# Altium schematic sheet PERIPHERALS.SchDoc
size A4
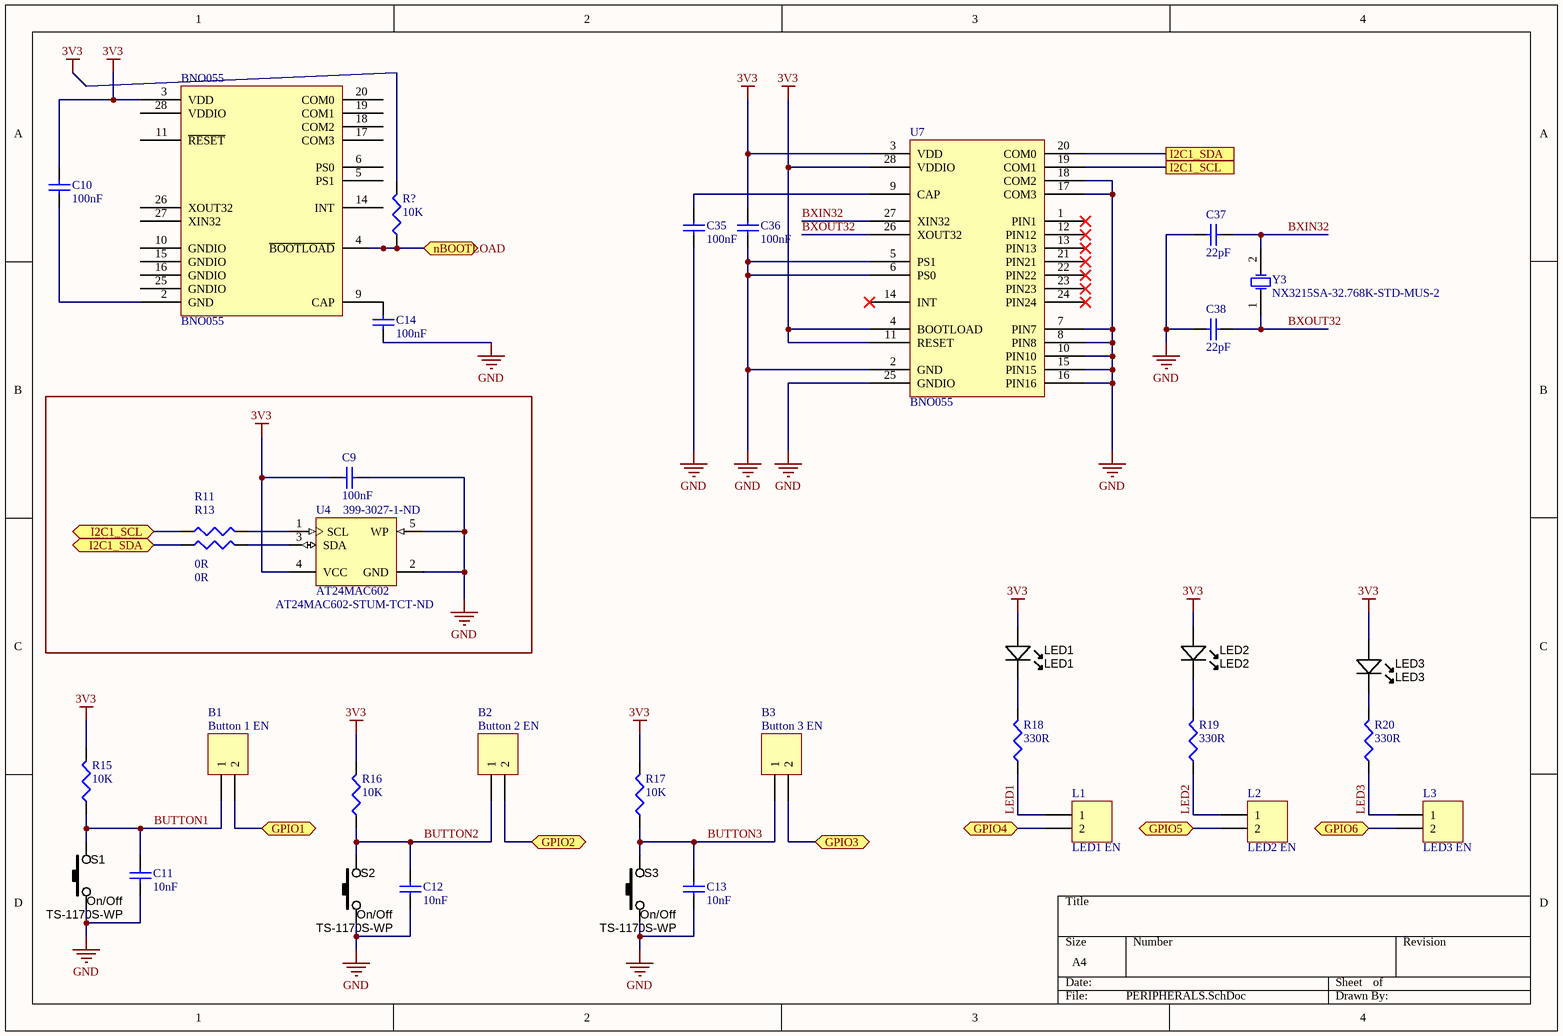
[diagram p0: PERIPHERALS.SchDoc]

## Parts
B1  Button 1 EN  [HDR1X2]
B2  Button 2 EN  [HDR1X2]
B3  Button 3 EN  [HDR1X2]
BNO055  BNO055  [BOSCH LGA-28 5.2x3.8MM]
C9  value 100nF  Supplier Part Number 1: 399-3027-1-ND  [0402C-TBD]  (hidden comment: Cap Semi)
C10  value 100nF  [0402C-TBD]  (hidden comment: Cap Semi)
C11  value 10nF  [0402C-TBD]  (hidden comment: Cap Semi)
C12  value 10nF  [0402C-TBD]  (hidden comment: Cap Semi)
C13  value 10nF  [0402C-TBD]  (hidden comment: Cap Semi)
C14  value 100nF  [0402C-TBD]  (hidden comment: Cap Semi)
C35  value 100nF  [0402C-TBD]  (hidden comment: Cap Semi)
C36  value 100nF  [0402C-TBD]  (hidden comment: Cap Semi)
C37  value 22pF  [0402C-TBD]  (hidden comment: Cap Semi)
C38  value 22pF  [0402C-TBD]  (hidden comment: Cap Semi)
L1  LED1 EN  [HDR1X2]
L2  LED2 EN  [HDR1X2]
L3  LED3 EN  [HDR1X2]
LED1  LED1  [LED-0603-GREEN]
LED2  LED2  [LED-0603-GREEN]
LED3  LED3  [LED-0603-GREEN]
R11  value 0R  [0402R-TBD]  (hidden comment: Res3)
R13  value 0R  [0402R-TBD]  (hidden comment: Res3)
R15  value 10K  [0402R-TBD]  (hidden comment: Res3)
R16  value 10K  [0402R-TBD]  (hidden comment: Res3)
R17  value 10K  [0402R-TBD]  (hidden comment: Res3)
R18  value 330R  [0402R-TBD]  (hidden comment: Res3)
R19  value 330R  [0402R-TBD]  (hidden comment: Res3)
R20  value 330R  [0402R-TBD]  (hidden comment: Res3)
R?  value 10K  [0402R-TBD]  (hidden comment: Res3)
S1  TS-1170S-WP  Function: On/Off  [TS-1170S]
S2  TS-1170S-WP  Function: On/Off  [TS-1170S]
S3  TS-1170S-WP  Function: On/Off  [TS-1170S]
U4  AT24MAC602  Supplier Part Number 1: AT24MAC602-STUM-TCT-ND  [ATML-5TS1-5_N]
U7  BNO055  [BNO055]
Y3  NX3215SA-32.768K-STD-MUS-2  [ABRA-ABS07-2_V]

## Ports
GPIO1 (bidir), GPIO2 (bidir), GPIO3 (bidir), GPIO4 (bidir), GPIO5 (bidir), GPIO6 (bidir), I2C1_SCL, I2C1_SCL (bidir), I2C1_SDA, I2C1_SDA (bidir), nBOOTLOAD (bidir)

## Nets
3V3: BNO055.3(VDD) C9.2 C10.2 C36.2 LED1.A LED2.A LED3.A R15.2 R16.2 R17.2 R?.2 U4.4(VCC) U7.3(VDD) U7.4(BOOTLOAD) U7.11(RESET) U7.28(VDDIO)
GND: C9.1 C11.1 C12.1 C13.1 C14.1 C35.1 C36.1 C37.2 C38.2 S1.1 S2.1 S3.1 U4.2(GND) U4.5(WP) U7.2(GND) U7.5(PS1) U7.6(PS0) U7.7(PIN7) U7.8(PIN8) U7.10(PIN10) U7.15(PIN15) U7.16(PIN16) U7.17(COM3) U7.18(COM2) U7.25(GNDIO)
BUTTON1: B1.1 C11.2 R15.1 S1.2
BUTTON2: B2.1 C12.2 R16.1 S2.2
BUTTON3: B3.1 C13.2 R17.1 S3.2
BXIN32: C37.1 U7.27(XIN32) Y3.2(X2)
BXOUT32: C38.1 U7.26(XOUT32) Y3.1(X1)
GPIO1: B1.2 ; port GPIO1
GPIO2: B2.2 ; port GPIO2
GPIO3: B3.2 ; port GPIO3
GPIO4: L1.2 ; port GPIO4
GPIO5: L2.2 ; port GPIO5
GPIO6: L3.2 ; port GPIO6
I2C1_SCL: R11.1 U7.19(COM1) ; port I2C1_SCL
I2C1_SDA: R13.1 U7.20(COM0) ; port I2C1_SDA
LED1: L1.1 R18.1
LED2: L2.1 R19.1
LED3: L3.1 R20.1
nBOOTLOAD: BNO055.4(~{BOOTL}~{OAD}) R?.1 ; port nBOOTLOAD
NetBNO055_2: BNO055.2(GND) C10.1
NetBNO055_9: BNO055.9(CAP) C14.2
NetC35_2: C35.2 U7.9(CAP)
NetLED1_K: LED1.K R18.2
NetLED2_K: LED2.K R19.2
NetLED3_K: LED3.K R20.2
NetR11_2: R11.2 U4.1(SCL)
NetR13_2: R13.2 U4.3(SDA)

Not connected (* = marked no-connect by the designer): BNO055 5(PS1) 6(PS0) 10(GNDIO) 11(~{RESET}) 14(INT) 15(GNDIO) 16(GNDIO) 17(COM3) 18(COM2) 19(COM1) 20(COM0) 25(GNDIO) 26(XOUT32) 27(XIN32) 28(VDDIO); U7 1(PIN1)* 12(PIN12)* 13(PIN13)* 14(INT)* 21(PIN21)* 22(PIN22)* 23(PIN23)* 24(PIN24)*

## Library data of the parts
B1-B3 L1-L3 = Header 2: Header, 2-Pin; LatestRevisionDate: 17-Jul-2002; LatestRevisionNote: Re-released for DXP Platform.; Publisher: Altium Limited
BNO055 = BNO055: 9 AXIS ORIENTATION SENSOR; Manufacturer: Bosch Sensortec; Sensor Type: Accelerometer, Gyroscope, Magnetometer, 3 Axis; Output Type: IC; Part Number: BNO055; PartId: 16469; Supplier 1: Digi-Key; Supplier Part Number 1: 828-1058-2-ND; ComponentLink1Description: Datasheet; ComponentLink1URL: https://ae-bst.resource.bosch.com/media/_tech/media/others/BST_Produktuebersicht_SCREEN_Final.pdf; ComponentLink2Description: Digi-Key Listing; ComponentLink2URL: http://www.digikey.com/product-detail/en/bosch-sensortec/BNO055/828-1058-2-ND/6136301; Price: 6.325; Type: Multifunction; Series: -; Operating Temperature: -40C ~ 85C (TA)
C9 C10 C14 C35 C36 = Cap Semi: Capacitor (Semiconductor SIM Model); Manufacturer: Kemet; Manufacturer Part Number: C0402C104K8PACTU; Capacitance: 0.1µF; Voltage - Rated: 10V; Tolerance: ±10%; Temperature Coefficient: X5R; Published: 8-Jun-2000; LatestRevisionDate: 29-May-2009; LatestRevisionNote: IPC-7351 Footprint Added.; PackageReference: C1206; Publisher: Altium Limited; PackageDescription: Chip Capacitor; Supplier 1: Digi-Key; RoHS: RoHS Compliant; Category: Capacitors; Stock 1: 563500; Pricing 1: 1=0.12, 10=0.03, 50=0.0166, 100=0.014, 250=0.01148, 500=0.0098, 1000=0.00763, 2500=0.00686, 5000=0.00636 (CAD); Packaging: Cut Tape (CT); Mounting Type: Surface Mount, MLCC; Operating Temperature: -55°C ~ 85°C; Applications: General Purpose; Ratings: -; Package / Case: 0402 (1005 Metric); Size / Dimension: 0.039" L x 0.020" W (1.00mm x 0.50mm); Height - Seated (Max): -; Thickness (Max): 0.022" (0.55mm); Lead Spacing: -; Features: -; Lead Style: -; ComponentLink1URL: http://www.kemet.com/docfinder?Partnumber=C0402C104K8PACTU; ComponentLink1Description: http://www.kemet.com/docfinder?Partnumber=C0402C104K8PACTU
  C10 C14 C35 C36: Supplier Part Number 1: 399-3027-1-ND
C11-C13 C37 C38 = Cap Semi: Capacitor (Semiconductor SIM Model); Published: 8-Jun-2000; LatestRevisionDate: 29-May-2009; LatestRevisionNote: IPC-7351 Footprint Added.; PackageReference: C1206; Publisher: Altium Limited; PackageDescription: Chip Capacitor
LED1-LED3 = LED_SMD_Green_0603_570nm: LED 0603 SMD Green 570nm 50mcd 20mA; Manufacturer 1: Kingbright Company LLC; Manufacturer Part Number 1: APT1608CGCK; Material: AlGaInP; Ratings: 20mcd min; 50 mcd typ; 570 nm; Voltage - Forward (Vf) Typ: 2.1V; Viewing Angle: 120°; Lens Style/Size: Rectangle with Flat Top, 1.1mm x 0.8mm; Voltage - Forward (Vf) @ 10mA: 2.0V; SCDType: source; Wavelength - Peak: 574nm; Lens Type: Clear; Package / Case: 0603 (1608 metric); Color: Green; Current - Test: 20mA; Supplier 1: Digi-Key; Supplier Part Number 1: 754-1116-1-ND; RoHS 1: RoHS Compliant; Wavelength - Dominant: 570nm; ComponentLink1URL: http://www.us.kingbright.com/images/catalog/SPEC/APT1608CGCK.pdf; ComponentLink1Description: http://www.us.kingbright.com/images/catalog/SPEC/APT1608CGCK.pdf
R11 R13 R15-R20 R? = Res3: Resistor; Published: 8-Jun-2000; LatestRevisionDate: 29-May-2009; LatestRevisionNote: IPC-7351 Footprint Added.; PackageReference: J1-0603; Publisher: Altium Limited; PackageDescription: Chip Resistor; Digi-Key Part Number: 541-120GCT-ND
S1-S3 = SW_SMD_PB_7.0mm: Switch SMD Tact 7.0mm Stem; Manufacturer 1: Bond-Tact; Manufacturer Part Number 1: TS-1170S-WP-200; SCDType: source; Package / Case: 6.5x6.5mm; 7.0mm stem; ComponentLink1URL: http://www.bondtact.com.hk/zaspx/productd.aspx?catno=3&subcatid=3&PageNo=2&productno=40; ComponentLink1Description: http://www.bondtact.com.hk/zaspx/productd.aspx?catno=3&subcatid=3&PageNo=2&productno=40
U4 = CMP-0152-00057-1: 1Kbit (128 x 8), 2-wire Bus Serial EEPROM with Write Protect, 1.7 to 5.5 V, -40 to 85 degC, SOT23-5, RoHS, Tape and Reel; Manufacturer: Atmel; PartNumber: AT24C01C-STUM-T; Manufacturer Part Number: AT24MAC602-STUM-T; Access Time (Max): 550 ns; DC Output Current: 5 mA; Frequency: 1 MHz; Format - Memory: EEPROMs - Serial (with MAC Address); Memory Size: 2K (256 x 8); Speed: 400kHz, 1MHz; Interface: I²C, 2-Wire Serial; Voltage - Supply: 1.7 V ~ 5.5 V; ComponentLink3Description: Package Specification; PackageVersion: 8700F; Mounting Technology: Surface Mount; Packing: Tape and Reel; ComponentLink1Description: Manufacturer URL; RoHS: TRUE; Operating Temperature: -40 to 85 degC; Operating Voltage: 1.7 to 5.5 V; PackageDescription: 5-Pin SOT23, Body 2.9 x 1.6 mm, Height 1.0mm, Pitch 0.95 mm; DatasheetVersion: Rev. 8700F; ComponentLink2URL: http://www.atmel.com/images/doc8700.pdf; ComponentLink3URL: http://www.atmel.com/images/doc8700.pdf; ComponentLink2Description: Datasheet; PackageReference: 5TS1; Device Density: 1 Kbit; ComponentLink1URL: http://www.atmel.com/; Supplier 1: Digi-Key; Category: Integrated Circuits (ICs); Stock 1: 4178; Pricing 1: 1=0.54, 10=0.537, 25=0.4988, 50=0.496, 100=0.4407, 250=0.4348, 500=0.42842, 1000=0.41684 (CAD); Packaging: Cut Tape (CT); Memory Type: EEPROM; Package / Case: SC-74A, SOT-753; Supplier Device Package: SOT-23-5; ComponentLink4URL: http://www.atmel.com/images/atmel-8807-seeprom-at24mac402-602-datasheet.pdf; ComponentLink4Description: http://www.atmel.com/images/atmel-8807-seeprom-at24mac402-602-datasheet.pdf
Y3 = CMP-0447-00001-2: Crystal, 32.768 kHz, 12.5 pF, -40 to 85 degC, SMD Low Profile 3.2 x 1.5 x 0.9 mm, Tape and Reel; Manufacturer: Abracon; PartNumber: ABS07-32.768KHz-T; Q Value (Type): 30000; Operation Mode: Flexural Mode (Tuning Fork); Shunt Capacitance (C0): 0.9 to 1.2 pF; Load Capacitance (CL): 12.5 pF; Frequency Tolerance @+25degC: +/- 20 ppm; Drive Level (Type): 0.1 uW; Equivalent Series Resistance (R1): 70 Kohm; Insulation Resistance (Min): 500 Mohm; ComponentLink3URL: http://www.abracon.com/Resonators/ABS07.pdf; PackageDescription: 2-Pin Hand Drawn, Body 3.2x1.5mm, Pitch 2.5mm; Operating Temperature: -40 to 85 degC; ComponentLink2URL: http://www.abracon.com/Resonators/ABS07.pdf; PackageReference: ABS07-2; ComponentLink3Description: Package Specification; ComponentLink1Description: Manufacturer URL; DatasheetVersion: 04.03.13; Mounting Technology: Surface Mount; ComponentLink2Description: Datasheet; ComponentLink1URL: http://www.abracon.com/; Packing: Tape and Reel; Frequency: 32.768 kHz; Digi-Key Part Number: 535-9542-6-ND